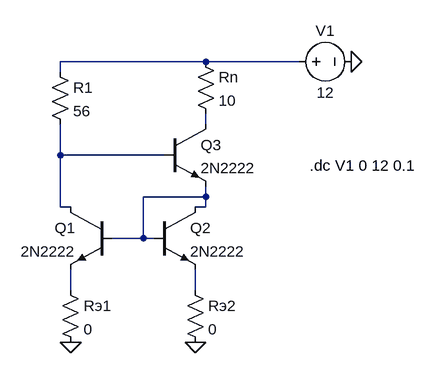
[diagram p0: schematic task2.asc]
task2.asc, the LTspice schematic file:
Version 4.1
SHEET 1 896 680
WIRE 368 64 144 64
WIRE 512 64 368 64
WIRE 144 80 144 64
WIRE 368 160 368 144
WIRE 144 208 144 160
WIRE 304 208 144 208
WIRE 368 272 368 256
WIRE 368 272 272 272
WIRE 144 288 144 208
WIRE 160 288 144 288
WIRE 368 288 368 272
WIRE 368 288 352 288
WIRE 272 336 272 272
WIRE 272 336 224 336
WIRE 288 336 272 336
WIRE 160 416 160 384
WIRE 352 416 352 384
FLAG 160 496 0
FLAG 352 496 0
FLAG 592 64 0
SYMBOL npn 224 288 M0
SYMATTR InstName Q1
SYMATTR Value 2N2222
SYMBOL npn 288 288 R0
SYMATTR InstName Q2
SYMATTR Value 2N2222
SYMBOL res 144 400 R0
SYMATTR InstName Rэ1
SYMATTR Value 0
SYMBOL res 336 400 R0
SYMATTR InstName Rэ2
SYMATTR Value 0
SYMBOL voltage 496 64 R270
WINDOW 0 32 56 VTop 2
WINDOW 3 -32 56 VBottom 2
SYMATTR InstName V1
SYMATTR Value 12
SYMBOL npn 304 160 R0
SYMATTR InstName Q3
SYMATTR Value 2N2222
SYMBOL res 128 64 R0
SYMATTR InstName R1
SYMATTR Value 56
SYMBOL res 352 48 R0
SYMATTR InstName Rn
SYMATTR Value 10
TEXT 528 224 Left 2 !.dc V1 0 12 0.1

The netlist it stands for:
* task2.asc
Q1 N003 N004 N005 0 2N2222
Q2 N004 N004 N006 0 2N2222
Rэ1 N005 0 0
Rэ2 N006 0 0
V1 N001 0 12
Q3 N002 N003 N004 0 2N2222
R1 N001 N003 56
Rn N001 N002 10
.model NPN NPN
.model PNP PNP
.lib standard.bjt
.dc V1 0 12 0.1
.backanno
.end